# Altium schematic sheet UI.SchDoc
size A4
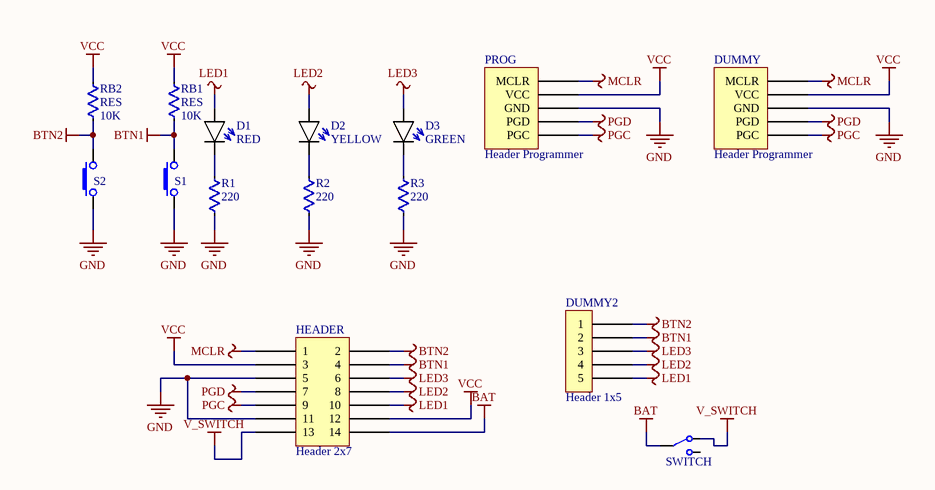
[diagram p0: UI.SchDoc]

## Parts
D1  COLOR: RED  [LED-3MM-RED]  (hidden comment: LED)
D2  COLOR: YELLOW  [LED-3MM-YELLOW]  (hidden comment: LED)
D3  COLOR: GREEN  [LED-3MM-GREEN]  (hidden comment: LED)
DUMMY  Header Programmer  [Header 1x5]
DUMMY2  Header 1x5  [Header 1x5]
HEADER  Header 2x7  [HEADER 2x7]
PROG  Header Programmer  [Header 1x5]
R1  value 220  [RES-Axial-400mil]  (hidden comment: RES)
R2  value 220  [RES-Axial-400mil]  (hidden comment: RES)
R3  value 220  [RES-Axial-400mil]  (hidden comment: RES)
RB1  RES  value 10K  [RES-Axial-400mil]
RB2  RES  value 10K  [RES-Axial-400mil]
S1  BUTTON_SMALL_4PIN  [TACT_SWITCH-SMALL-4PIN]  (value not drawn)
S2  BUTTON_SMALL_4PIN  [TACT_SWITCH-SMALL-4PIN]  (value not drawn)
SWITCH  SLIDE-SWITCH  [SWITCH]  (value not drawn)

## Nets
BAT: HEADER.14 SWITCH.2
BTN1: DUMMY2.2 HEADER.4 RB1.1 S1.2
BTN2: DUMMY2.1 HEADER.2 RB2.1 S2.2
GND: DUMMY.3(GND) HEADER.5 HEADER.11 PROG.3(GND) R1.1 R2.1 R3.1 S1.1 S2.1
LED1: D1.A DUMMY2.5 HEADER.10
LED2: D2.A DUMMY2.4 HEADER.8
LED3: D3.A DUMMY2.3 HEADER.6
MCLR: DUMMY.1(MCLR) HEADER.1 PROG.1(MCLR)
PGC: DUMMY.5(PGC) HEADER.9 PROG.5(PGC)
PGD: DUMMY.4(PGD) HEADER.7 PROG.4(PGD)
V_SWITCH: HEADER.13 SWITCH.1
VCC: DUMMY.2(VCC) HEADER.3 HEADER.12 PROG.2(VCC) RB1.2 RB2.2
NetD1_K: D1.K R1.2
NetD2_K: D2.K R2.2
NetD3_K: D3.K R3.2

Not connected (* = marked no-connect by the designer): SWITCH 3